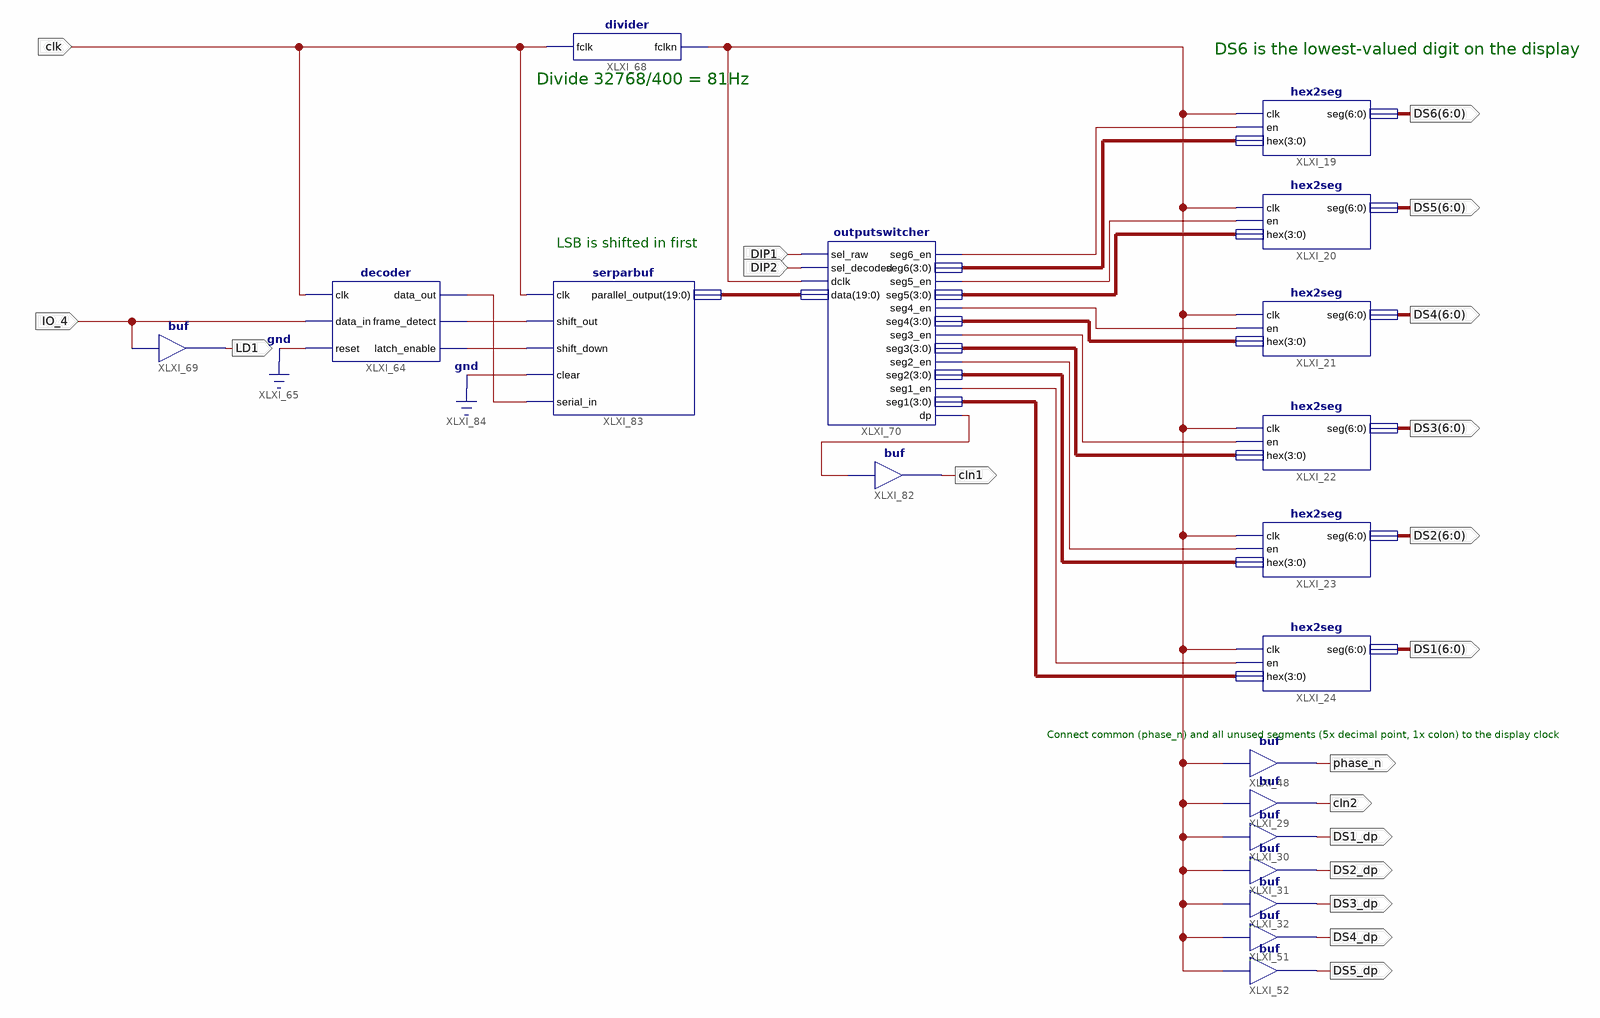
[diagram p0: schematic sheet 1]
// Xilinx ISE schematic toplevel.sch (xbr) as structural Verilog: 19 symbols, 19 ports
module toplevel (
  input  DIP2,
  input  DIP1,
  input  IO_4,
  input  clk,
  output cln1,
  output DS5_dp,
  output DS4_dp,
  output DS3_dp,
  output DS2_dp,
  output DS1_dp,
  output cln2,
  output [6:0] DS4,
  output [6:0] DS3,
  output [6:0] DS2,
  output [6:0] DS1,
  output [6:0] DS5,
  output [6:0] DS6,
  output phase_n,
  output LD1
);

  wire XLXN_147, XLXN_151, XLXN_153, XLXN_155, XLXN_157, XLXN_159, XLXN_161, XLXN_163, XLXN_166, XLXN_167,
       XLXN_169;
  wire [3:0] XLXN_152, XLXN_154, XLXN_156, XLXN_158, XLXN_160, XLXN_162;
  wire [19:0] XLXN_236;

  outputswitcher XLXI_70 (
    .sel_raw(DIP1), .seg6_en(XLXN_151), .seg5_en(XLXN_153), .seg4_en(XLXN_155), .seg3_en(XLXN_157),
    .seg2_en(XLXN_159), .seg1_en(XLXN_161), .dp(XLXN_163), .seg6(XLXN_152), .seg5(XLXN_154), .seg4(XLXN_156),
    .seg3(XLXN_158), .seg2(XLXN_160), .seg1(XLXN_162), .sel_decoded(DIP2), .dclk(XLXN_147), .data(XLXN_236));
  buf XLXI_82 (cln1, XLXN_163);
  buf XLXI_52 (DS5_dp, XLXN_147);
  buf XLXI_51 (DS4_dp, XLXN_147);
  buf XLXI_32 (DS3_dp, XLXN_147);
  buf XLXI_31 (DS2_dp, XLXN_147);
  buf XLXI_30 (DS1_dp, XLXN_147);
  buf XLXI_29 (cln2, XLXN_147);
  hex2seg XLXI_23 (.clk(XLXN_147), .seg(DS2), .en(XLXN_159), .hex(XLXN_160));
  hex2seg XLXI_22 (.clk(XLXN_147), .seg(DS3), .en(XLXN_157), .hex(XLXN_158));
  hex2seg XLXI_21 (.clk(XLXN_147), .seg(DS4), .en(XLXN_155), .hex(XLXN_156));
  hex2seg XLXI_20 (.clk(XLXN_147), .seg(DS5), .en(XLXN_153), .hex(XLXN_154));
  hex2seg XLXI_24 (.clk(XLXN_147), .seg(DS1), .en(XLXN_161), .hex(XLXN_162));
  buf XLXI_48 (phase_n, XLXN_147);
  hex2seg XLXI_19 (.clk(XLXN_147), .seg(DS6), .en(XLXN_151), .hex(XLXN_152));
  serparbuf XLXI_83 (
    .clk(clk), .shift_out(XLXN_166), .shift_down(XLXN_167), .clear(1'b0), .serial_in(XLXN_169),
    .parallel_output(XLXN_236));
  divider XLXI_68 (.fclk(clk), .fclkn(XLXN_147));
  decoder XLXI_64 (
    .clk(clk), .data_in(IO_4), .reset(1'b0), .data_out(XLXN_169), .frame_detect(XLXN_166),
    .latch_enable(XLXN_167));
  buf XLXI_69 (LD1, IO_4);

  // Notes on the sheet:
  //   DS6 is the lowest-valued digit on the display
  //   Divide 32768/400 = 81Hz
  //   LSB is shifted in first
  //   Connect common (phase_n) and all unused segments (5x decimal point, 1x colon) to the display clock
endmodule
